# Altium schematic sheet PF2_AudioInput.SchDoc
size 254 x 241 mm
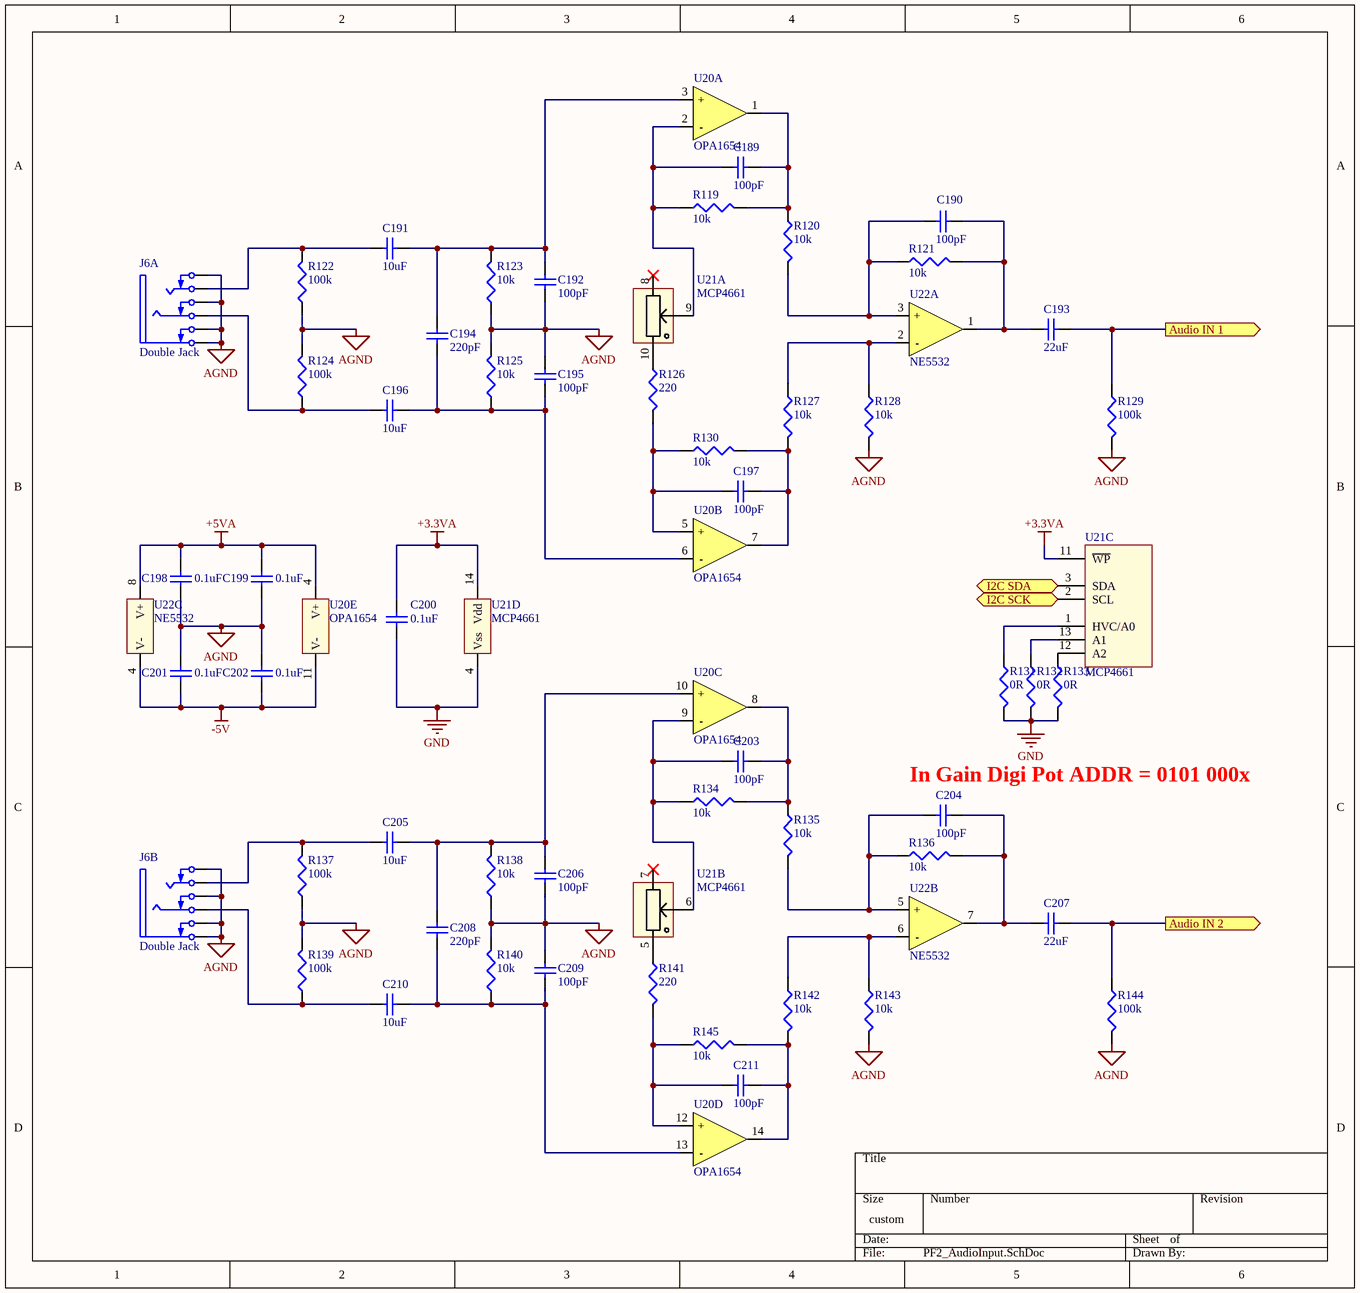
[diagram p0: PF2_AudioInput.SchDoc]

## Parts
C189  100pF  [CAPC1608X08]
C190  100pF  [CAPC1608X08]
C191  10uF  [CAPC1608X08]
C192  100pF  [CAPC1608X08]
C193  22uF  [CAPC1608X08]
C194  220pF  [CAPC1608X08]
C195  100pF  [CAPC1608X08]
C196  10uF  [CAPC1608X08]
C197  100pF  [CAPC1608X08]
C198  0.1uF  [CAPC1608X08]
C199  0.1uF  [CAPC1608X08]
C200  0.1uF  [CAPC1608X08]
C201  0.1uF  [CAPC1608X08]
C202  0.1uF  [CAPC1608X08]
C203  100pF  [CAPC1608X08]
C204  100pF  [CAPC1608X08]
C205  10uF  [CAPC1608X08]
C206  100pF  [CAPC1608X08]
C207  22uF  [CAPC1608X08]
C208  220pF  [CAPC1608X08]
C209  100pF  [CAPC1608X08]
C210  10uF  [CAPC1608X08]
C211  100pF  [CAPC1608X08]
J6  Double Jack  [Amphenol_ACJS-MHDC]  (parts A,B of 2)
R119  10k  [RESC1608X05]
R120  10k  [RESC1608X05]
R121  10k  [RESC1608X05]
R122  100k  [RESC1608X05]
R123  10k  [RESC1608X05]
R124  100k  [RESC1608X05]
R125  10k  [RESC1608X05]
R126  220  [RESC1608X05]
R127  10k  [RESC1608X05]
R128  10k  [RESC1608X05]
R129  100k  [RESC1608X05]
R130  10k  [RESC1608X05]
R131  0R  [RESC1608X05]
R132  0R  [RESC1608X05]
R133  0R  [RESC1608X05]
R134  10k  [RESC1608X05]
R135  10k  [RESC1608X05]
R136  10k  [RESC1608X05]
R137  100k  [RESC1608X05]
R138  10k  [RESC1608X05]
R139  100k  [RESC1608X05]
R140  10k  [RESC1608X05]
R141  220  [RESC1608X05]
R142  10k  [RESC1608X05]
R143  10k  [RESC1608X05]
R144  100k  [RESC1608X05]
R145  10k  [RESC1608X05]
U20  OPA1654  [D14-M]  (parts A,B,C,D,E of 5)
U21  MCP4661  [TSSOP14_MC-M]  (parts A,B,C,D of 4)
U22  NE5532  [D8-M]  (parts A,B,C of 3)

## Ports
Audio IN 1 (out), Audio IN 2 (out), I2C SCK, I2C SDA

## Nets
+3.3VA: C200.1 U21.11(~{WP}) U21.14(Vdd)
+5VA: C198.1 C199.1 U20.4(V+) U22.8(V+)
-5V: C201.2 C202.2 U20.11(V-) U22.4(V-)
AGND: C192.2 C195.1 C198.2 C199.2 C201.1 C202.1 C206.2 C209.1 J6.1(SB) J6.2(RB) J6.3(TB) J6.4(S) J6.7(SB) J6.8(RB) J6.9(TB) J6.10(S) R122.1 R123.1 R124.2 R125.2 R128.2 R129.2 R137.1 R138.1 R139.2 R140.2 R143.2 R144.2
GND: C200.2 R131.2 R132.2 R133.2 U21.4(Vss)
Audio IN 1: C193.1 R129.1 ; port Audio IN 1
Audio IN 2: C207.1 R144.1 ; port Audio IN 2
I2C SCK: U21.2(SCL) ; port I2C SCK
I2C SDA: U21.3(SDA) ; port I2C SDA
NetC189_1: C189.1 R119.1 U20.2(-) U21.9(P0W)
NetC189_2: C189.2 R119.2 R120.1 U20.1(OUT)
NetC190_1: C190.1 R120.2 R121.1 U22.3(+)
NetC190_2: C190.2 C193.2 R121.2 U22.1(OUT)
NetC191_1: C191.1 C192.1 C194.1 R123.2 U20.3(+)
NetC191_2: C191.2 J6.12(T) R122.2
NetC194_2: C194.2 C195.2 C196.1 R125.1 U20.6(-)
NetC196_2: C196.2 J6.11(R) R124.1
NetC197_1: C197.1 R126.2 R130.1 U20.5(+)
NetC197_2: C197.2 R127.2 R130.2 U20.7(OUT)
NetC203_1: C203.1 R134.1 U20.9(-) U21.6(P1W)
NetC203_2: C203.2 R134.2 R135.1 U20.8(OUT)
NetC204_1: C204.1 R135.2 R136.1 U22.5(+)
NetC204_2: C204.2 C207.2 R136.2 U22.7(OUT)
NetC205_1: C205.1 C206.1 C208.1 R138.2 U20.10(+)
NetC205_2: C205.2 J6.6(T) R137.2
NetC208_2: C208.2 C209.2 C210.1 R140.1 U20.13(-)
NetC210_2: C210.2 J6.5(R) R139.1
NetC211_1: C211.1 R141.2 R145.1 U20.12(+)
NetC211_2: C211.2 R142.2 R145.2 U20.14(OUT)
NetR126_1: R126.1 U21.10(P0B)
NetR127_1: R127.1 R128.1 U22.2(-)
NetR131_1: R131.1 U21.1(HVC/A0)
NetR132_1: R132.1 U21.13(A1)
NetR133_1: R133.1 U21.12(A2)
NetR141_1: R141.1 U21.5(P1B)
NetR142_1: R142.1 R143.1 U22.6(-)

Not connected (* = marked no-connect by the designer): U21 7(P1A)* 8(P0A)*

## Notes on the sheet
- (near C204) In Gain Digi Pot ADDR = 0101 000x

## Library data of the parts
C189 C190 C192 C195 C197 C203 C204 C206 C209 C211 = Cap Semi: Capacitor (Semiconductor SIM Model); Fabricant: MURATA; Fournisseur: Farnell; RefFabricant: GRT1885C1H101JA02D; RefFournisseur: 2672133; Value: 100pF; Case: 0603 [1608 Metric]; DataSheet: http://www.farnell.com/datasheets/2165936.pdf
C191 C196 C205 C210 = Cap Semi: Capacitor (Semiconductor SIM Model); Fabricant: MURATA; Fournisseur: Farnell; RefFabricant: GRM188R60J106ME47J; RefFournisseur: 2611921; Value: 10uF; Case: 0603 [1608 Metric]; DataSheet: http://www.farnell.com/datasheets/2079165.pdf
C193 C207 = Cap Semi: Capacitor (Semiconductor SIM Model); Fabricant: MURATA; Fournisseur: Farnell; RefFabricant: GRM188R60J226MEA0D; RefFournisseur: 2666490; Value: 22uF; Case: 0603 [1608 Metric]; DataSheet: http://www.farnell.com/datasheets/1955681.pdf
C194 C208 = Cap Semi: Capacitor (Semiconductor SIM Model); Fabricant: MURATA; Fournisseur: Farnell; RefFabricant: GRM1885C1H221JA01D; RefFournisseur: 8819882; Value: 220pF; Case: 0603 [1608 Metric]; DataSheet: http://www.farnell.com/datasheets/2048203.pdf
C198-C202 = Cap Semi: Capacitor (Semiconductor SIM Model); Fabricant: MURATA; Fournisseur: Farnell; RefFabricant: GRM188F51E104ZA01D; RefFournisseur: 2821272; Value: 0.1uF; Case: 0603 [1608 Metric]; DataSheet: http://www.farnell.com/datasheets/2048672.pdf
J6 = Dual TRS Jack Bypassed: Dual Jack stereo bypassed; Fabricant: AMPHENOL; Fournisseur: Farnell; RefFabricant: ACJS-MHDC; RefFournisseur: 2771861; DataSheet: http://www.farnell.com/datasheets/866888.pdf
R119-R121 R123 R125 R127 R128 R130 R134-R136 R138 R140 R142 R143 R145 = Res3: Resistor; Fabricant: TE CONNECTIVITY; Fournisseur: Farnell; RefFabricant: CPF-A-0603B4K7E1; RefFournisseur: 2483933; Value: 10k; Case: 0603 [1608 Metric]; DataSheet: http://www.farnell.com/datasheets/1935020.pdf
R122 R124 R129 R137 R139 R144 = Res3: Resistor; Fabricant: TE CONNECTIVITY; Fournisseur: Farnell; RefFabricant: RN73C1J100KBTDF; RefFournisseur: 2687850; Value: 100k; Case: 0603 [1608 Metric]; DataSheet: http://www.farnell.com/datasheets/2189072.pdf
R126 R141 = Res3: Resistor; Value: 220k; Fabricant: TE CONNECTIVITY; Fournisseur: Farnell; RefFabricant: CPF-A-0603B220KE1; RefFournisseur: 2483903; Case: 0603 [1608 Metric]; DataSheet: http://www.farnell.com/datasheets/1935020.pdf
R131-R133 = Res3: Resistor; Value: 0; Case: 0603 [1608 Metric]
U20 = OPA1654: Quad Audio OpAmp; Fabricant: TEXAS INSTRUMENTS; RefFournisseur: 2099889; Fournisseur: Farnell; RefFabricant: OPA1654; DataSheet: http://www.ti.com/lit/ds/symlink/opa1654.pdf
U21 = MCP4661: Dual DigiPot non volatile I2C; RefFournisseur: 1840724; RefFabricant: MCP4661-503E/ST; Fournisseur: Farnell; Fabricant: MICROCHIP; DataSheet: http://www.farnell.com/datasheets/2243913.pdf
U22 = NE5532: Dual Audio OpAmp; Fournisseur: Farnell; RefFournisseur: 1103060; Fabricant: TEXAS INSTRUMENTS; RefFabricant: NE5532; DataSheet: http://www.ti.com/lit/ds/symlink/ne5532a.pdf